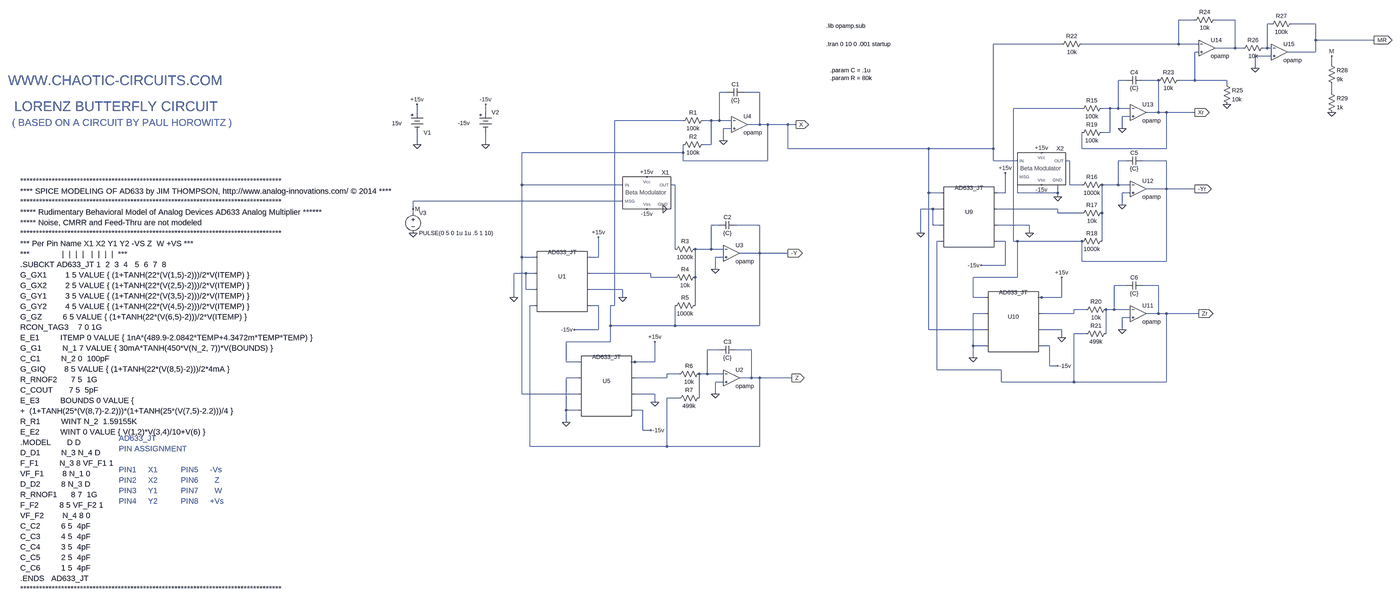
[diagram p0: schematic CSK_Ideal.asc, whole sheet]
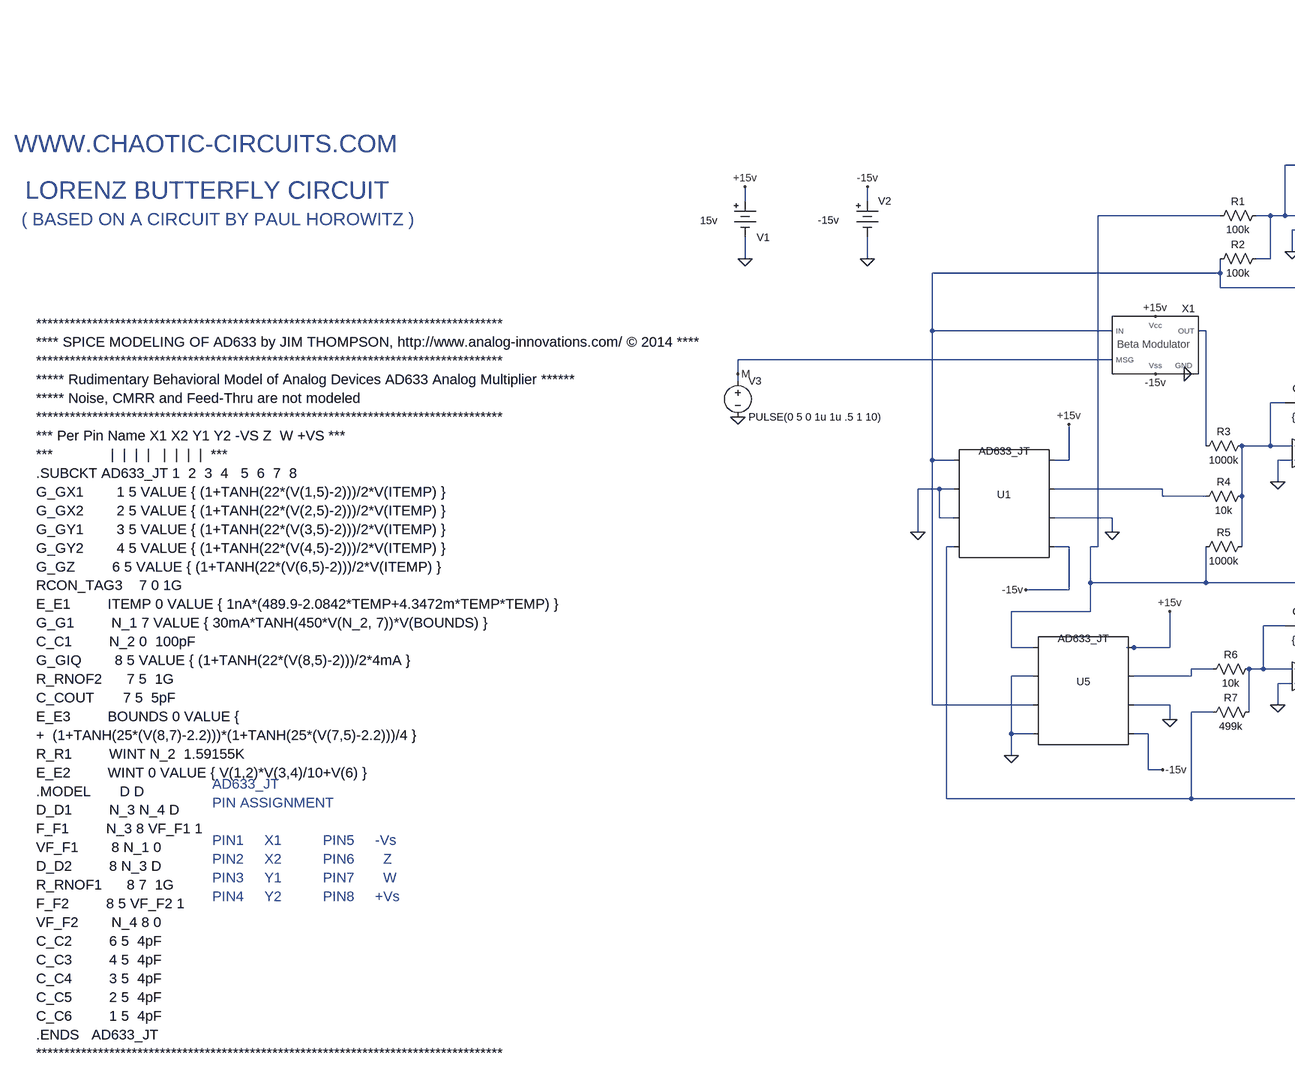
[diagram p1: schematic CSK_Ideal.asc, part, row 1 of 1, column 1 of 2]
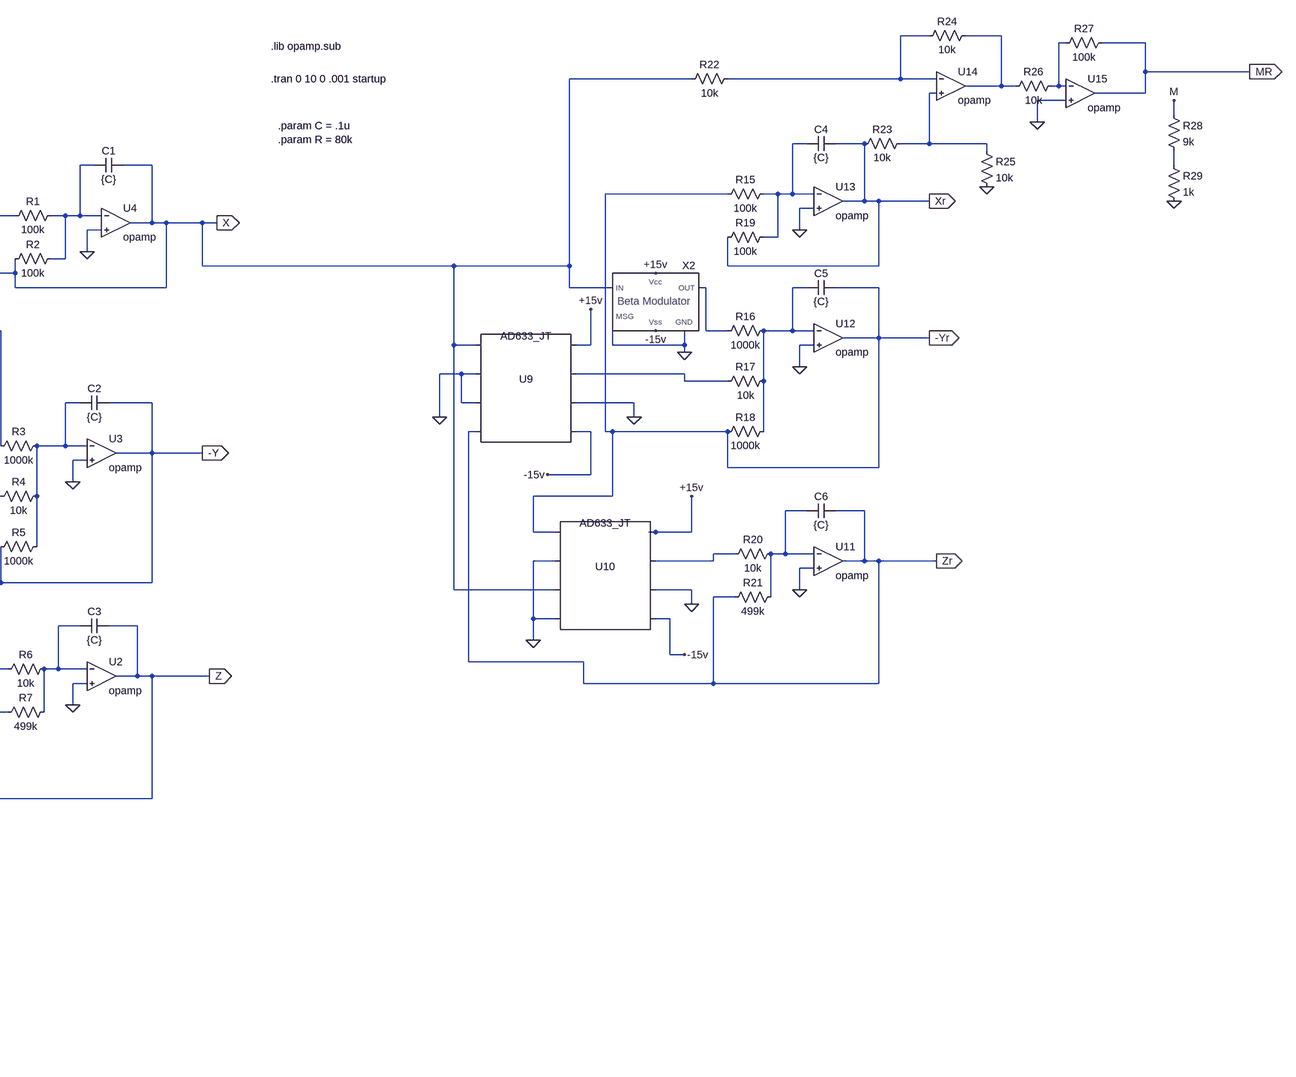
[diagram p2: schematic CSK_Ideal.asc, part, row 1 of 1, column 2 of 2]
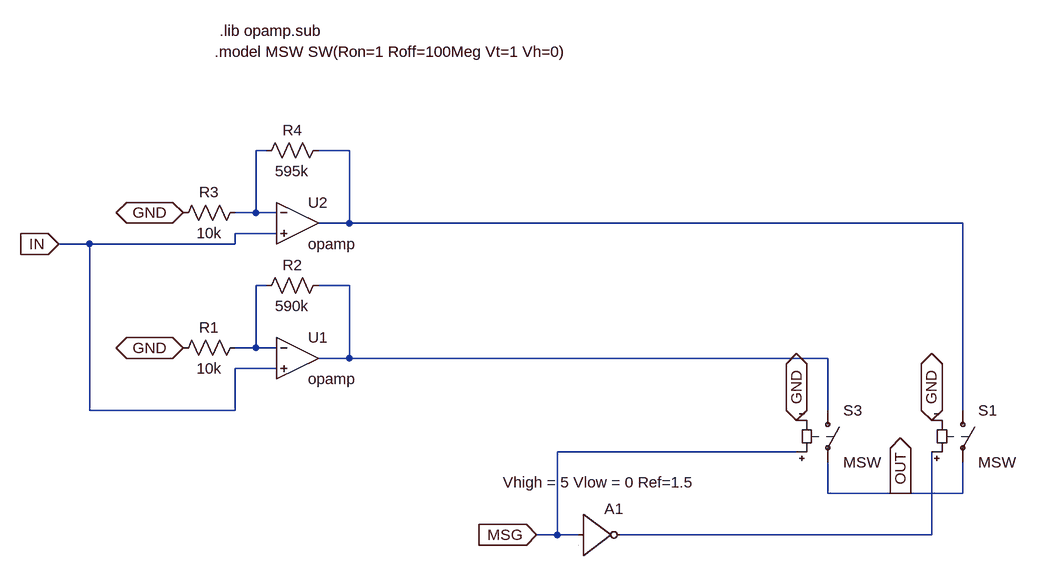
[diagram p3: sub-circuit betaswitch.asc]
CSK_Ideal.asc, the LTspice schematic file:
Version 4
SHEET 1 880 2376
WIRE -1568 256 -1632 256
WIRE -1408 256 -1488 256
WIRE -1264 272 -1280 272
WIRE -1088 272 -1184 272
WIRE -1088 336 -1088 272
WIRE -784 336 -1088 336
WIRE -2096 352 -2368 352
WIRE -1632 352 -1632 256
WIRE -1632 352 -2016 352
WIRE -1552 352 -1632 352
WIRE -1408 368 -1408 256
WIRE -1408 368 -1488 368
WIRE -1376 368 -1408 368
WIRE -1280 368 -1280 272
WIRE -1280 368 -1296 368
WIRE -1264 368 -1280 368
WIRE -1552 384 -1568 384
WIRE -1088 384 -1088 336
WIRE -1088 384 -1200 384
WIRE -1264 400 -1328 400
WIRE -1024 432 -1024 400
WIRE -1328 448 -1328 400
WIRE -1840 496 -1872 496
WIRE -1712 496 -1776 496
WIRE -1568 496 -1568 384
WIRE -1568 496 -1632 496
WIRE -1440 496 -1568 496
WIRE -1440 512 -1440 496
WIRE -3440 544 -3472 544
WIRE -3312 544 -3376 544
WIRE -1024 544 -1024 512
WIRE -2016 608 -2288 608
WIRE -1904 608 -1936 608
WIRE -1872 608 -1872 496
WIRE -1872 608 -1904 608
WIRE -1824 608 -1872 608
WIRE -4672 624 -4672 592
WIRE -4400 624 -4400 592
WIRE -1712 624 -1712 496
WIRE -1712 624 -1760 624
WIRE -1680 624 -1712 624
WIRE -1568 624 -1680 624
WIRE -1824 640 -1856 640
WIRE -3616 656 -3888 656
WIRE -3504 656 -3536 656
WIRE -3472 656 -3472 544
WIRE -3472 656 -3504 656
WIRE -3424 656 -3472 656
WIRE -3312 672 -3312 544
WIRE -3312 672 -3360 672
WIRE -3280 672 -3312 672
WIRE -3200 672 -3280 672
WIRE -3168 672 -3200 672
WIRE -3424 688 -3456 688
WIRE -1856 688 -1856 640
WIRE -1904 704 -1904 608
WIRE -1904 704 -1936 704
WIRE -3456 736 -3456 688
WIRE -4672 752 -4672 704
WIRE -4400 752 -4400 704
WIRE -3504 752 -3504 656
WIRE -3504 752 -3536 752
WIRE -3200 768 -3200 672
WIRE -2624 768 -3200 768
WIRE -2368 768 -2368 352
WIRE -2368 768 -2624 768
WIRE -2016 768 -2016 704
WIRE -1680 768 -1680 624
WIRE -1680 768 -2016 768
WIRE -3616 784 -3616 752
WIRE -3616 784 -4256 784
WIRE -3616 816 -3616 784
WIRE -3280 816 -3280 672
WIRE -3280 816 -3616 816
WIRE -2368 816 -2368 768
WIRE -2272 816 -2368 816
WIRE -2064 816 -2080 816
WIRE -1840 816 -1872 816
WIRE -1680 816 -1776 816
WIRE -4256 912 -4256 784
WIRE -3856 912 -4256 912
WIRE -3648 912 -3664 912
WIRE -2064 912 -2064 816
WIRE -2016 912 -2064 912
WIRE -1872 912 -1872 816
WIRE -1872 912 -1936 912
WIRE -1824 912 -1872 912
WIRE -1680 928 -1680 816
WIRE -1680 928 -1760 928
WIRE -1568 928 -1680 928
WIRE -2624 944 -2624 768
WIRE -2576 944 -2624 944
WIRE -2320 944 -2320 864
WIRE -2320 944 -2352 944
WIRE -2272 944 -2272 880
WIRE -2112 944 -2112 912
WIRE -2112 944 -2272 944
WIRE -1824 944 -1856 944
WIRE -2112 960 -2112 944
WIRE -3856 976 -4688 976
WIRE -1856 992 -1856 944
WIRE -4688 1008 -4688 976
WIRE -2608 1008 -2656 1008
WIRE -2576 1008 -2608 1008
WIRE -2112 1008 -2352 1008
WIRE -4688 1024 -4688 1008
WIRE -2112 1024 -2112 1008
WIRE -2016 1024 -2112 1024
WIRE -1936 1024 -1936 912
WIRE -3472 1072 -3504 1072
WIRE -3312 1072 -3408 1072
WIRE -2608 1072 -2608 1008
WIRE -2576 1072 -2608 1072
WIRE -2224 1072 -2352 1072
WIRE -2656 1104 -2656 1008
WIRE -2224 1104 -2224 1072
WIRE -2576 1136 -2592 1136
WIRE -2320 1136 -2352 1136
WIRE -2288 1136 -2288 608
WIRE -2272 1136 -2288 1136
WIRE -2016 1136 -2272 1136
WIRE -1936 1136 -1936 1024
WIRE -3648 1168 -3648 912
WIRE -3504 1168 -3504 1072
WIRE -3504 1168 -3568 1168
WIRE -3456 1168 -3504 1168
WIRE -3312 1184 -3312 1072
WIRE -3312 1184 -3392 1184
WIRE -3200 1184 -3312 1184
WIRE -4256 1200 -4256 912
WIRE -4208 1200 -4256 1200
WIRE -3952 1200 -3952 1120
WIRE -3952 1200 -3984 1200
WIRE -3456 1200 -3488 1200
WIRE -2016 1216 -2016 1136
WIRE -1680 1216 -1680 928
WIRE -1680 1216 -2016 1216
WIRE -2320 1232 -2320 1136
WIRE -2320 1232 -2416 1232
WIRE -3488 1248 -3488 1200
WIRE -4240 1264 -4288 1264
WIRE -4208 1264 -4240 1264
WIRE -3744 1264 -3984 1264
WIRE -3744 1280 -3744 1264
WIRE -3648 1280 -3744 1280
WIRE -3568 1280 -3568 1168
WIRE -2272 1280 -2272 1136
WIRE -2272 1280 -2448 1280
WIRE -1840 1312 -1888 1312
WIRE -1712 1312 -1776 1312
WIRE -4240 1328 -4240 1264
WIRE -4208 1328 -4240 1328
WIRE -3856 1328 -3984 1328
WIRE -4288 1360 -4288 1264
WIRE -3856 1360 -3856 1328
WIRE -2448 1360 -2448 1280
WIRE -2400 1360 -2448 1360
WIRE -2176 1360 -2192 1360
WIRE -2096 1360 -2096 1280
WIRE -2096 1360 -2176 1360
WIRE -4208 1392 -4224 1392
WIRE -3952 1392 -3984 1392
WIRE -3888 1392 -3888 656
WIRE -3888 1392 -3904 1392
WIRE -3568 1392 -3568 1280
WIRE -2000 1408 -2048 1408
WIRE -1888 1408 -1888 1312
WIRE -1888 1408 -1920 1408
WIRE -1824 1408 -1888 1408
WIRE -2400 1424 -2448 1424
WIRE -2048 1424 -2048 1408
WIRE -2048 1424 -2176 1424
WIRE -1712 1424 -1712 1312
WIRE -1712 1424 -1760 1424
WIRE -1680 1424 -1712 1424
WIRE -1552 1424 -1680 1424
WIRE -1824 1440 -1856 1440
WIRE -3904 1472 -3904 1392
WIRE -3648 1472 -3648 1392
WIRE -3648 1472 -3904 1472
WIRE -3312 1472 -3312 1184
WIRE -3312 1472 -3648 1472
WIRE -3952 1488 -3952 1392
WIRE -3952 1488 -4048 1488
WIRE -2624 1488 -2624 944
WIRE -2400 1488 -2624 1488
WIRE -2096 1488 -2176 1488
WIRE -1856 1488 -1856 1440
WIRE -2000 1504 -2048 1504
WIRE -1920 1504 -1920 1408
WIRE -2096 1520 -2096 1488
WIRE -3904 1536 -3904 1472
WIRE -3904 1536 -4080 1536
WIRE -2448 1552 -2448 1424
WIRE -2400 1552 -2448 1552
WIRE -2144 1552 -2176 1552
WIRE -3472 1568 -3520 1568
WIRE -3344 1568 -3408 1568
WIRE -2448 1600 -2448 1552
WIRE -4080 1616 -4080 1536
WIRE -4032 1616 -4080 1616
WIRE -3808 1616 -3824 1616
WIRE -3728 1616 -3728 1536
WIRE -3728 1616 -3808 1616
WIRE -2144 1632 -2144 1552
WIRE -2112 1632 -2144 1632
WIRE -2592 1648 -2592 1136
WIRE -2336 1648 -2592 1648
WIRE -3632 1664 -3680 1664
WIRE -3520 1664 -3520 1568
WIRE -3520 1664 -3552 1664
WIRE -3456 1664 -3520 1664
WIRE -4032 1680 -4080 1680
WIRE -3680 1680 -3680 1664
WIRE -3680 1680 -3808 1680
WIRE -3344 1680 -3344 1568
WIRE -3344 1680 -3392 1680
WIRE -3312 1680 -3344 1680
WIRE -3184 1680 -3312 1680
WIRE -3456 1696 -3488 1696
WIRE -2336 1696 -2336 1648
WIRE -2048 1696 -2048 1504
WIRE -2048 1696 -2336 1696
WIRE -1680 1696 -1680 1424
WIRE -1680 1696 -2048 1696
WIRE -4256 1744 -4256 1200
WIRE -4032 1744 -4256 1744
WIRE -3728 1744 -3808 1744
WIRE -3488 1744 -3488 1696
WIRE -3632 1760 -3680 1760
WIRE -3552 1760 -3552 1664
WIRE -3728 1776 -3728 1744
WIRE -4080 1808 -4080 1680
WIRE -4032 1808 -4080 1808
WIRE -3776 1808 -3808 1808
WIRE -4080 1856 -4080 1808
WIRE -3776 1888 -3776 1808
WIRE -3744 1888 -3776 1888
WIRE -4224 1952 -4224 1392
WIRE -3680 1952 -3680 1760
WIRE -3680 1952 -4224 1952
WIRE -3312 1952 -3312 1680
WIRE -3312 1952 -3680 1952
FLAG -3168 672 X
IOPIN -3168 672 Out
FLAG -3184 1680 Z
IOPIN -3184 1680 Out
FLAG -3456 736 0
FLAG -3488 1248 0
FLAG -3488 1744 0
FLAG -4672 752 0
FLAG -4400 752 0
FLAG -3200 1184 -Y
IOPIN -3200 1184 Out
FLAG -4672 592 +15v
FLAG -4400 592 -15v
FLAG -3952 1120 +15v
FLAG -3728 1536 +15v
FLAG -3744 1888 -15v
FLAG -4048 1488 -15v
FLAG -3728 1776 0
FLAG -3856 1360 0
FLAG -4288 1360 0
FLAG -4080 1856 0
FLAG -4688 1104 0
FLAG -1568 624 Xr
IOPIN -1568 624 Out
FLAG -1552 1424 Zr
IOPIN -1552 1424 Out
FLAG -1856 688 0
FLAG -1856 992 0
FLAG -1856 1488 0
FLAG -1568 928 -Yr
IOPIN -1568 928 Out
FLAG -2320 864 +15v
FLAG -2096 1280 +15v
FLAG -2112 1632 -15v
FLAG -2416 1232 -15v
FLAG -2096 1520 0
FLAG -2224 1104 0
FLAG -2656 1104 0
FLAG -2448 1600 0
FLAG -1440 592 0
FLAG -784 336 MR
IOPIN -784 336 Out
FLAG -1328 448 0
FLAG -4688 1008 M
FLAG -1024 400 M
FLAG -1024 624 0
FLAG -3760 1008 -15v
FLAG -3760 880 +15v
FLAG -3696 1008 0
FLAG -2176 912 -15v
FLAG -2176 784 +15v
FLAG -2112 960 0
SYMBOL res -3632 672 R270
WINDOW 0 32 56 VTop 2
WINDOW 3 0 56 VBottom 2
SYMATTR InstName R1
SYMATTR Value 100k
SYMATTR SpiceLine tol=1
SYMBOL res -3664 1184 R270
WINDOW 0 32 56 VTop 2
WINDOW 3 0 56 VBottom 2
SYMATTR InstName R3
SYMATTR Value 1000k
SYMATTR SpiceLine tol=1
SYMBOL res -3664 1296 R270
WINDOW 0 32 56 VTop 2
WINDOW 3 0 56 VBottom 2
SYMATTR InstName R4
SYMATTR Value 10k
SYMATTR SpiceLine tol=1
SYMBOL res -3664 1408 R270
WINDOW 0 32 56 VTop 2
WINDOW 3 0 56 VBottom 2
SYMATTR InstName R5
SYMATTR Value 1000k
SYMATTR SpiceLine tol=1
SYMBOL res -3632 768 R270
WINDOW 0 32 56 VTop 2
WINDOW 3 0 56 VBottom 2
SYMATTR InstName R2
SYMATTR Value 100k
SYMATTR SpiceLine tol=1
SYMBOL cap -3440 560 R270
WINDOW 0 32 32 VTop 2
WINDOW 3 0 32 VBottom 2
SYMATTR InstName C1
SYMATTR Value {C}
SYMBOL cap -3472 1088 R270
WINDOW 0 32 32 VTop 2
WINDOW 3 0 32 VBottom 2
SYMATTR InstName C2
SYMATTR Value {C}
SYMBOL cap -3472 1584 R270
WINDOW 0 32 32 VTop 2
WINDOW 3 0 32 VBottom 2
SYMATTR InstName C3
SYMATTR Value {C}
SYMBOL res -3648 1680 R270
WINDOW 0 32 56 VTop 2
WINDOW 3 0 56 VBottom 2
SYMATTR InstName R6
SYMATTR Value 10k
SYMATTR SpiceLine tol=1
SYMBOL res -3648 1776 R270
WINDOW 0 32 56 VTop 2
WINDOW 3 0 56 VBottom 2
SYMATTR InstName R7
SYMATTR Value 499k
SYMATTR SpiceLine tol=1
SYMBOL Misc\\battery -4672 608 R0
WINDOW 0 26 97 Left 2
WINDOW 3 -100 59 Left 2
WINDOW 123 0 0 Left 2
WINDOW 39 0 0 Left 2
SYMATTR InstName V1
SYMATTR Value 15v
SYMBOL Misc\\battery -4400 608 R0
WINDOW 3 -110 58 Left 2
WINDOW 123 0 0 Left 2
WINDOW 39 0 0 Left 2
SYMATTR Value -15v
SYMATTR InstName V2
SYMBOL Misc\\DIP8 -4096 1296 R0
WINDOW 3 0 -116 Center 2
SYMATTR Value AD633_JT
SYMATTR InstName U1
SYMBOL Misc\\DIP8 -3920 1712 R0
WINDOW 3 0 -116 Center 2
SYMATTR Value AD633_JT
SYMATTR InstName U5
SYMBOL Opamps\\opamp -3424 1616 R0
SYMATTR InstName U2
SYMBOL Opamps\\opamp -3424 1120 R0
SYMATTR InstName U3
SYMBOL Opamps\\opamp -3392 608 R0
SYMATTR InstName U4
SYMBOL voltage -4688 1008 R0
WINDOW 123 0 0 Left 2
WINDOW 39 0 0 Left 2
SYMATTR InstName V3
SYMATTR Value PULSE(0 5 0 1u 1u .5 1 10)
SYMBOL res -2032 624 R270
WINDOW 0 32 56 VTop 2
WINDOW 3 0 56 VBottom 2
SYMATTR InstName R15
SYMATTR Value 100k
SYMATTR SpiceLine tol=1
SYMBOL res -2032 928 R270
WINDOW 0 32 56 VTop 2
WINDOW 3 0 56 VBottom 2
SYMATTR InstName R16
SYMATTR Value 1000k
SYMATTR SpiceLine tol=1
SYMBOL res -2032 1040 R270
WINDOW 0 32 56 VTop 2
WINDOW 3 0 56 VBottom 2
SYMATTR InstName R17
SYMATTR Value 10k
SYMATTR SpiceLine tol=1
SYMBOL res -2032 1152 R270
WINDOW 0 32 56 VTop 2
WINDOW 3 0 56 VBottom 2
SYMATTR InstName R18
SYMATTR Value 1000k
SYMATTR SpiceLine tol=1
SYMBOL res -2032 720 R270
WINDOW 0 32 56 VTop 2
WINDOW 3 0 56 VBottom 2
SYMATTR InstName R19
SYMATTR Value 100k
SYMATTR SpiceLine tol=1
SYMBOL cap -1840 512 R270
WINDOW 0 32 32 VTop 2
WINDOW 3 0 32 VBottom 2
SYMATTR InstName C4
SYMATTR Value {C}
SYMBOL cap -1840 832 R270
WINDOW 0 32 32 VTop 2
WINDOW 3 0 32 VBottom 2
SYMATTR InstName C5
SYMATTR Value {C}
SYMBOL cap -1840 1328 R270
WINDOW 0 32 32 VTop 2
WINDOW 3 0 32 VBottom 2
SYMATTR InstName C6
SYMATTR Value {C}
SYMBOL res -2016 1424 R270
WINDOW 0 32 56 VTop 2
WINDOW 3 0 56 VBottom 2
SYMATTR InstName R20
SYMATTR Value 10k
SYMATTR SpiceLine tol=1
SYMBOL res -2016 1520 R270
WINDOW 0 32 56 VTop 2
WINDOW 3 0 56 VBottom 2
SYMATTR InstName R21
SYMATTR Value 499k
SYMATTR SpiceLine tol=1
SYMBOL Misc\\DIP8 -2464 1040 R0
WINDOW 3 0 -116 Center 2
SYMATTR Value AD633_JT
SYMATTR InstName U9
SYMBOL Misc\\DIP8 -2288 1456 R0
WINDOW 3 0 -116 Center 2
SYMATTR Value AD633_JT
SYMATTR InstName U10
SYMBOL Opamps\\opamp -1792 1360 R0
SYMATTR InstName U11
SYMBOL Opamps\\opamp -1792 864 R0
SYMATTR InstName U12
SYMBOL Opamps\\opamp -1792 560 R0
SYMATTR InstName U13
SYMBOL Opamps\\opamp -1520 304 R0
SYMATTR InstName U14
SYMBOL res -2000 336 R90
WINDOW 0 0 56 VBottom 2
WINDOW 3 32 56 VTop 2
SYMATTR InstName R22
SYMATTR Value 10k
SYMBOL res -1616 480 R90
WINDOW 0 0 56 VBottom 2
WINDOW 3 32 56 VTop 2
SYMATTR InstName R23
SYMATTR Value 10k
SYMBOL res -1472 240 R90
WINDOW 0 0 56 VBottom 2
WINDOW 3 32 56 VTop 2
SYMATTR InstName R24
SYMATTR Value 10k
SYMBOL res -1456 496 R0
SYMATTR InstName R25
SYMATTR Value 10k
SYMBOL Opamps\\opamp -1232 320 R0
SYMATTR InstName U15
SYMBOL res -1280 352 R90
WINDOW 0 0 56 VBottom 2
WINDOW 3 32 56 VTop 2
SYMATTR InstName R26
SYMATTR Value 10k
SYMBOL res -1168 256 R90
WINDOW 0 0 56 VBottom 2
WINDOW 3 32 56 VTop 2
SYMATTR InstName R27
SYMATTR Value 100k
SYMBOL res -1040 416 R0
SYMATTR InstName R28
SYMATTR Value 9k
SYMBOL res -1040 528 R0
SYMATTR InstName R29
SYMATTR Value 1k
SYMBOL BetaSwitch -3744 944 R0
SYMATTR InstName X1
SYMBOL BetaSwitch -2160 848 R0
SYMATTR InstName X2
TEXT -3048 352 Left 2 !.tran 0 10 0 .001 startup
TEXT -6280 664 Left 4 ;( BASED ON A CIRCUIT BY PAUL HOROWITZ )
TEXT -6272 600 Left 5 ;LORENZ BUTTERFLY CIRCUIT
TEXT -6296 496 Left 5 ;WWW.CHAOTIC-CIRCUITS.COM
TEXT -6248 896 Left 3 !***********************************************************************************\n**** SPICE MODELING OF AD633 by JIM THOMPSON, http://www.analog-innovations.com/ © 2014 ****\n***********************************************************************************\n***** Rudimentary Behavioral Model of Analog Devices AD633 Analog Multiplier ******\n***** Noise, CMRR and Feed-Thru are not modeled\n***********************************************************************************\n*** Per Pin Name X1 X2 Y1 Y2 -VS Z  W +VS ***\n***              |  |  |  |   |  |  |  |  ***\n.SUBCKT AD633_JT 1  2  3  4   5  6  7  8 \nG_GX1        1 5 VALUE { (1+TANH(22*(V(1,5)-2)))/2*V(ITEMP) }\nG_GX2        2 5 VALUE { (1+TANH(22*(V(2,5)-2)))/2*V(ITEMP) }\nG_GY1        3 5 VALUE { (1+TANH(22*(V(3,5)-2)))/2*V(ITEMP) }\nG_GY2        4 5 VALUE { (1+TANH(22*(V(4,5)-2)))/2*V(ITEMP) }\nG_GZ         6 5 VALUE { (1+TANH(22*(V(6,5)-2)))/2*V(ITEMP) }\nRCON_TAG3    7 0 1G\nE_E1         ITEMP 0 VALUE { 1nA*(489.9-2.0842*TEMP+4.3472m*TEMP*TEMP) }\nG_G1         N_1 7 VALUE { 30mA*TANH(450*V(N_2, 7))*V(BOUNDS) }\nC_C1         N_2 0  100pF \nG_GIQ        8 5 VALUE { (1+TANH(22*(V(8,5)-2)))/2*4mA }\nR_RNOF2      7 5  1G \nC_COUT       7 5  5pF \nE_E3         BOUNDS 0 VALUE {\n+  (1+TANH(25*(V(8,7)-2.2)))*(1+TANH(25*(V(7,5)-2.2)))/4 }\nR_R1         WINT N_2  1.59155K \nE_E2         WINT 0 VALUE { V(1,2)*V(3,4)/10+V(6) }\n.MODEL       D D\nD_D1         N_3 N_4 D \nF_F1         N_3 8 VF_F1 1\nVF_F1        8 N_1 0\nD_D2         8 N_3 D \nR_RNOF1      8 7  1G \nF_F2         8 5 VF_F2 1\nVF_F2        N_4 8 0\nC_C2         6 5  4pF \nC_C3         4 5  4pF \nC_C4         3 5  4pF \nC_C5         2 5  4pF \nC_C6         1 5  4pF \n.ENDS   AD633_JT\n***********************************************************************************
TEXT -5856 1920 Left 3 ;AD633_JT\nPIN ASSIGNMENT\n \nPIN1     X1          PIN5     -Vs\nPIN2     X2          PIN6       Z\nPIN3     Y1          PIN7       W\nPIN4     Y2          PIN8     +Vs
TEXT -3048 280 Left 2 !.lib opamp.sub
TEXT -3032 456 Left 2 !.param C = .1u\n.param R = 80k

betaswitch.asc, the sub-circuit schematic file:
Version 4
SHEET 1 1068 712
WIRE -96 48 -112 48
WIRE 32 48 -16 48
WIRE -112 144 -112 48
WIRE -112 144 -144 144
WIRE -80 144 -112 144
WIRE 32 160 32 48
WIRE 32 160 -16 160
WIRE 976 160 32 160
WIRE -80 176 -144 176
WIRE -368 192 -416 192
WIRE -144 192 -144 176
WIRE -144 192 -368 192
WIRE -96 256 -112 256
WIRE 32 256 -16 256
WIRE -112 352 -112 256
WIRE -112 352 -144 352
WIRE -80 352 -112 352
WIRE 32 368 32 256
WIRE 32 368 -16 368
WIRE 768 368 32 368
WIRE -80 384 -144 384
WIRE -368 448 -368 192
WIRE -144 448 -144 384
WIRE -144 448 -368 448
WIRE 768 448 768 368
WIRE 976 448 976 160
WIRE 720 512 352 512
WIRE 768 576 768 528
WIRE 880 576 768 576
WIRE 976 576 976 528
WIRE 976 576 880 576
WIRE 352 640 352 512
WIRE 352 640 320 640
WIRE 384 640 352 640
WIRE 928 640 928 512
WIRE 928 640 448 640
FLAG -224 144 GND
IOPIN -224 144 BiDir
FLAG -416 192 IN
IOPIN -416 192 In
FLAG 880 576 OUT
IOPIN 880 576 Out
FLAG 320 640 MSG
IOPIN 320 640 In
FLAG 720 464 GND
IOPIN 720 464 BiDir
FLAG 928 464 GND
IOPIN 928 464 BiDir
FLAG -224 352 GND
IOPIN -224 352 BiDir
SYMBOL Opamps\\opamp -48 96 R0
SYMATTR InstName U2
SYMBOL res -128 128 R90
WINDOW 0 0 56 VBottom 2
WINDOW 3 32 56 VTop 2
SYMATTR InstName R3
SYMATTR Value 10k
SYMBOL res 0 32 R90
WINDOW 0 0 56 VBottom 2
WINDOW 3 32 56 VTop 2
SYMATTR InstName R4
SYMATTR Value 595k
SYMBOL Digital\\inv 384 576 R0
WINDOW 3 -116 -17 Left 2
SYMATTR Value Vhigh = 5 Vlow = 0 Ref=1.5
SYMATTR InstName A1
SYMATTR Value2 Trise = 1n Tfall = 1n Td =1n
SYMBOL Opamps\\opamp -48 304 R0
SYMATTR InstName U1
SYMBOL res -128 336 R90
WINDOW 0 0 56 VBottom 2
WINDOW 3 32 56 VTop 2
SYMATTR InstName R1
SYMATTR Value 10k
SYMBOL res 0 240 R90
WINDOW 0 0 56 VBottom 2
WINDOW 3 32 56 VTop 2
SYMATTR InstName R2
SYMATTR Value 590k
SYMBOL sw 768 432 R0
SYMATTR InstName S3
SYMATTR Value MSW
SYMBOL sw 976 432 R0
SYMATTR InstName S1
SYMATTR Value MSW
TEXT -168 -136 Left 2 !.lib opamp.sub
TEXT -176 -104 Left 2 !.model MSW SW(Ron=1 Roff=100Meg Vt=1 Vh=0)

The netlist it stands for:
* CSK_Ideal.asc
R1 -Y N006 100k tol=1
R3 N010 N012 1000k tol=1
R4 N013 N012 10k tol=1
R5 -Y N012 1000k tol=1
R2 X N006 100k tol=1
C1 N006 X {C}
C2 N012 -Y {C}
C3 N016 Z {C}
R6 N017 N016 10k tol=1
R7 Z N016 499k tol=1
V1 +15v 0 15v
V2 -15v 0 -15v
XU1 X 0 0 Z -15v 0 N013 +15v AD633_JT
XU5 -Y 0 X 0 -15v 0 N017 +15v AD633_JT
XU2 N016 0 Z opamp Aol=100K GBW=10Meg  ; pins invin noninvin out
XU3 N012 0 -Y opamp Aol=100K GBW=10Meg  ; pins invin noninvin out
XU4 N006 0 X opamp Aol=100K GBW=10Meg  ; pins invin noninvin out
V3 M 0 PULSE(0 5 0 1u 1u .5 1 10)
R15 -Yr N005 100k tol=1
R16 N008 N009 1000k tol=1
R17 N011 N009 10k tol=1
R18 -Yr N009 1000k tol=1
R19 Xr N005 100k tol=1
C4 N005 Xr {C}
C5 N009 -Yr {C}
C6 N014 Zr {C}
R20 N015 N014 10k tol=1
R21 Zr N014 499k tol=1
XU9 X 0 0 Zr -15v 0 N011 +15v AD633_JT
XU10 -Yr 0 X 0 -15v 0 N015 +15v AD633_JT
XU11 N014 0 Zr opamp Aol=100K GBW=10Meg  ; pins invin noninvin out
XU12 N009 0 -Yr opamp Aol=100K GBW=10Meg  ; pins invin noninvin out
XU13 N005 0 Xr opamp Aol=100K GBW=10Meg  ; pins invin noninvin out
XU14 N001 N004 N002 opamp Aol=100K GBW=10Meg  ; pins invin noninvin out
R22 N001 X 10k
R23 N004 Xr 10k
R24 N002 N001 10k
R25 N004 0 10k
XU15 N003 0 MR opamp Aol=100K GBW=10Meg  ; pins invin noninvin out
R26 N003 N002 10k
R27 MR N003 100k
R28 M N007 9k
R29 N007 0 1k
XX1 +15v -15v 0 X M N010 betaswitch
XX2 +15v -15v 0 X 0 N008 betaswitch

* block symbol definitions
.subckt betaswitch Vcc Vss GND IN MSG OUT
XU2 N001 IN N002 opamp Aol=100K GBW=10Meg  ; pins invin noninvin out
R3 N001 GND 10k
R4 N002 N001 595k
A1 MSG 0 0 0 0 N005 0 0 BUF Vhigh = 5 Vlow = 0 Ref=1.5 Trise = 1n Tfall = 1n Td =1n
XU1 N003 IN N004 opamp Aol=100K GBW=10Meg  ; pins invin noninvin out
R1 N003 GND 10k
R2 N004 N003 590k
S3 N004 OUT MSG GND MSW
S1 N002 OUT N005 GND MSW
.lib opamp.sub
.model MSW SW(Ron=1 Roff=100Meg Vt=1 Vh=0)
.ends betaswitch

.tran 0 10 0 .001 startup
* ( BASED ON A CIRCUIT BY PAUL HOROWITZ )
* LORENZ BUTTERFLY CIRCUIT
* WWW.CHAOTIC-CIRCUITS.COM
***********************************************************************************
**** SPICE MODELING OF AD633 by JIM THOMPSON, http://www.analog-innovations.com/ © 2014 ****
***********************************************************************************
***** Rudimentary Behavioral Model of Analog Devices AD633 Analog Multiplier ******
***** Noise, CMRR and Feed-Thru are not modeled
***********************************************************************************
*** Per Pin Name X1 X2 Y1 Y2 -VS Z  W +VS ***
***              |  |  |  |   |  |  |  |  ***
.SUBCKT AD633_JT 1  2  3  4   5  6  7  8
G_GX1        1 5 VALUE { (1+TANH(22*(V(1,5)-2)))/2*V(ITEMP) }
G_GX2        2 5 VALUE { (1+TANH(22*(V(2,5)-2)))/2*V(ITEMP) }
G_GY1        3 5 VALUE { (1+TANH(22*(V(3,5)-2)))/2*V(ITEMP) }
G_GY2        4 5 VALUE { (1+TANH(22*(V(4,5)-2)))/2*V(ITEMP) }
G_GZ         6 5 VALUE { (1+TANH(22*(V(6,5)-2)))/2*V(ITEMP) }
RCON_TAG3    7 0 1G
E_E1         ITEMP 0 VALUE { 1nA*(489.9-2.0842*TEMP+4.3472m*TEMP*TEMP) }
G_G1         N_1 7 VALUE { 30mA*TANH(450*V(N_2, 7))*V(BOUNDS) }
C_C1         N_2 0  100pF
G_GIQ        8 5 VALUE { (1+TANH(22*(V(8,5)-2)))/2*4mA }
R_RNOF2      7 5  1G
C_COUT       7 5  5pF
E_E3         BOUNDS 0 VALUE {
+  (1+TANH(25*(V(8,7)-2.2)))*(1+TANH(25*(V(7,5)-2.2)))/4 }
R_R1         WINT N_2  1.59155K
E_E2         WINT 0 VALUE { V(1,2)*V(3,4)/10+V(6) }
.MODEL       D D
D_D1         N_3 N_4 D
F_F1         N_3 8 VF_F1 1
VF_F1        8 N_1 0
D_D2         8 N_3 D
R_RNOF1      8 7  1G
F_F2         8 5 VF_F2 1
VF_F2        N_4 8 0
C_C2         6 5  4pF
C_C3         4 5  4pF
C_C4         3 5  4pF
C_C5         2 5  4pF
C_C6         1 5  4pF
.ENDS   AD633_JT
***********************************************************************************
* AD633_JT
* PIN ASSIGNMENT
* PIN1     X1          PIN5     -Vs
* PIN2     X2          PIN6       Z
* PIN3     Y1          PIN7       W
* PIN4     Y2          PIN8     +Vs
.lib opamp.sub
.param C = .1u
.param R = 80k
.backanno
.end